# EasyEDA Pro project Příloha F.epro

# Board PCB_1
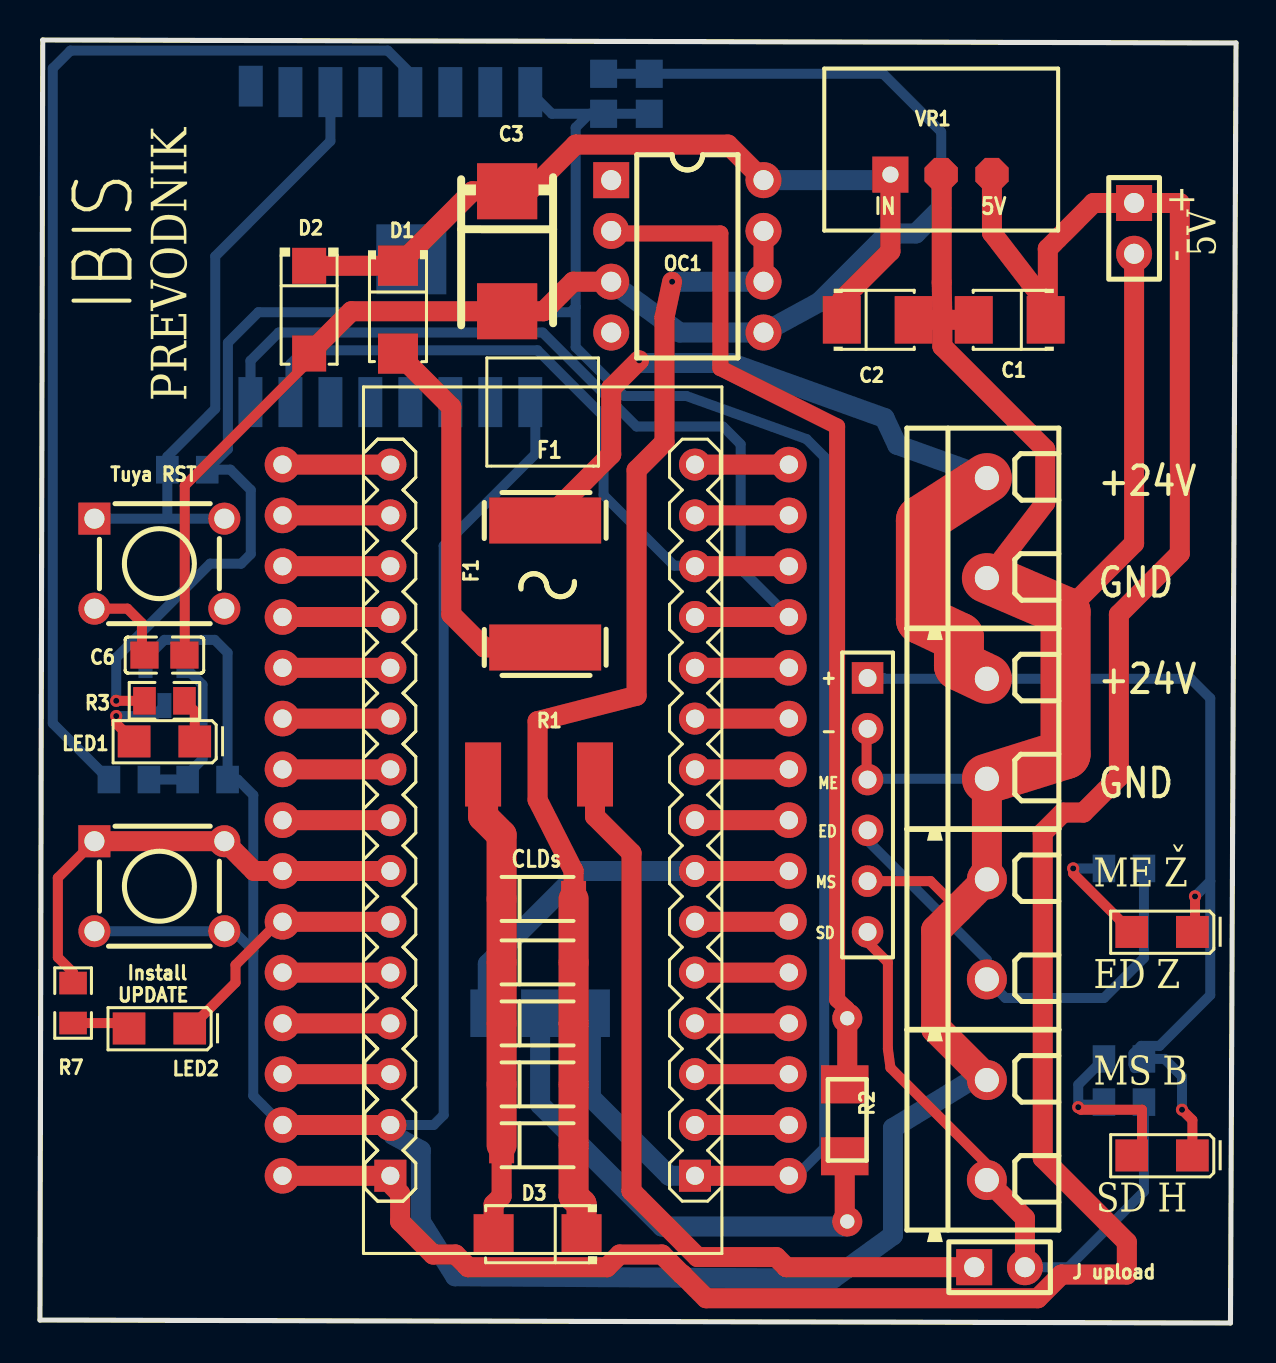
[diagram p0: board, top side]
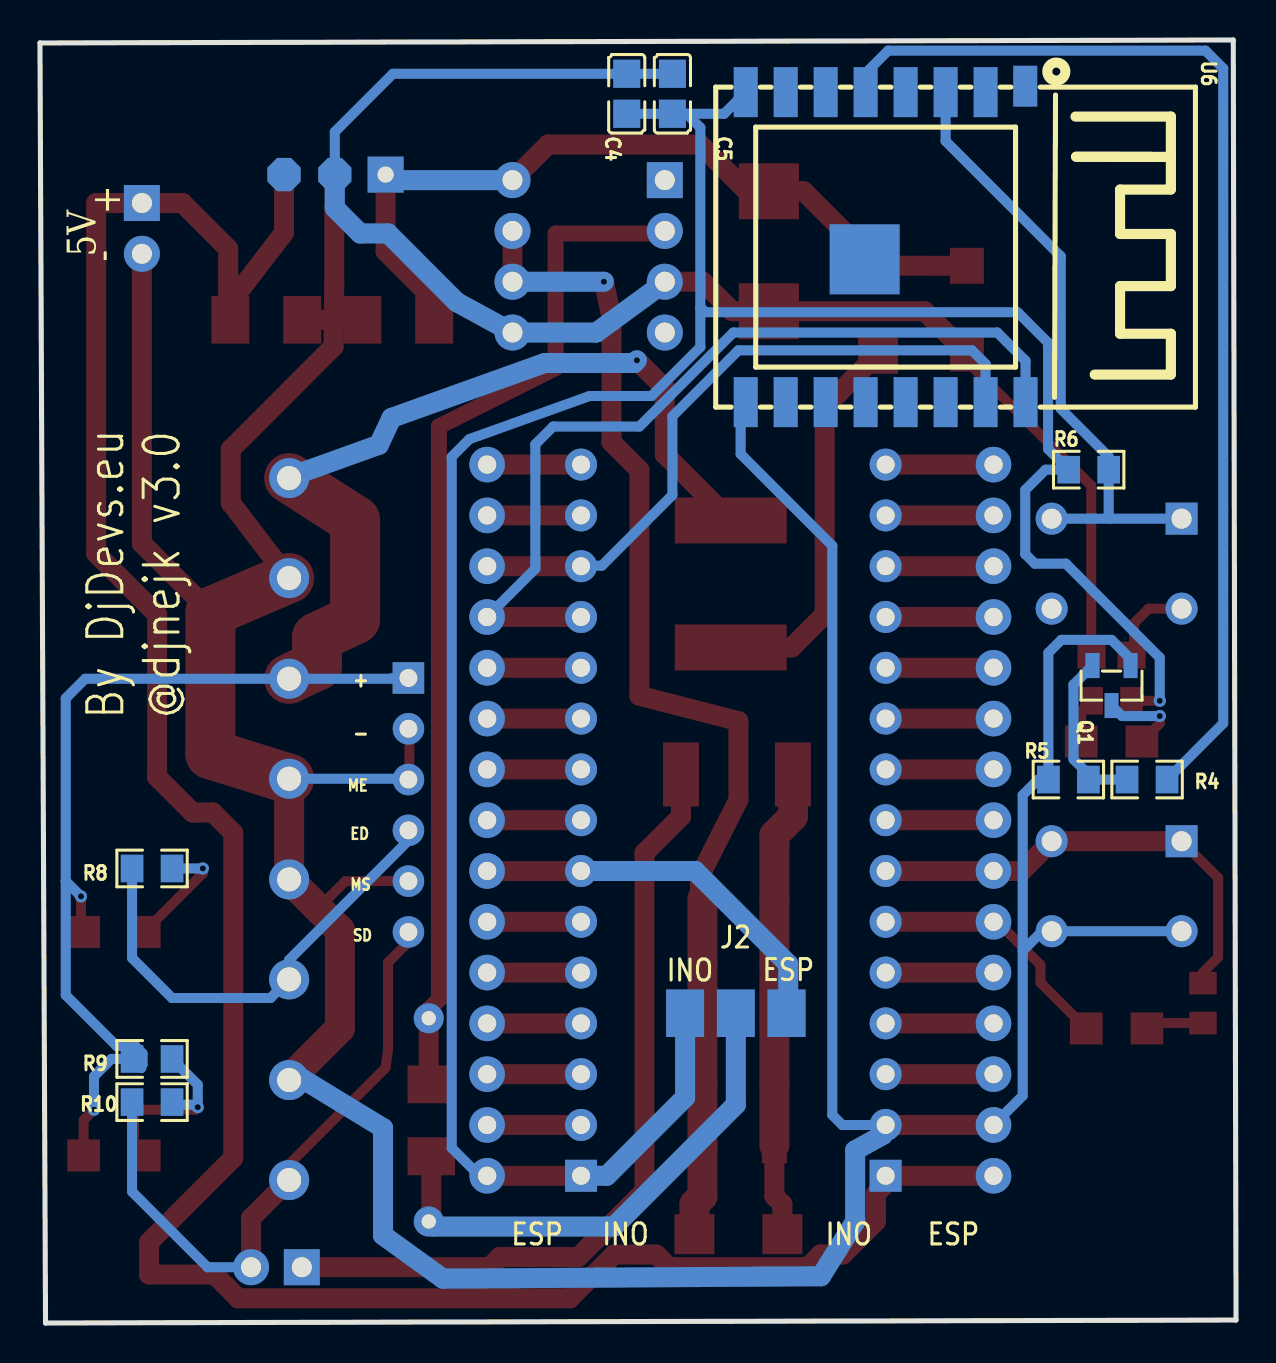
[diagram p1: board, bottom side, seen from below]

Outline 59.84 x 64.15 mm; copper layers: Top Layer, Bottom Layer. Coordinates in mm from the lower left corner of the outline.
Outline path: 0,0.15 0.14,64.15 59.84,64.01 59.56,0 0,0.15
Stack: Top Layer 0.035mm / Dielectric1 1.51mm FR4 er 4.5 / Bottom Layer 0.035mm

## Design rules (mm)
spacing Default (default): track to track 0.152, other pairs 0 to 0.152
track width Default (default): min 0.5, default 0.5, max 25.4
differential pair differentialPair (default): width min 0.127, default 0.254, max 2.54; gap min 0.152, default 0.152
via Default (default): diameter min 0.61, default 0.61, max 100.025; hole min 0.305, default 0.305, max 59.995

## Placement (name value [footprint] x y rotation side)
 Install
UPDATE  -  [KEY-TH_4P-L6.0-W6.0-P6.50-LS4.5]  5.97 21.84 0 top
C1  -  [CAP-SMD_L3.5-W2.8-FD]  48.52 50.16 180 top
C2  -  [CAP-SMD_L3.5-W2.8-FD]  41.92 50.16 0 top
C3  -  [CASE-D_7343]  23.37 53.59 90 top
C4  -  [C0805]  30.48 61.46 90 bottom
C5  -  [C0805]  28.2 61.46 90 bottom
C6  -  [C0805]  6.23 33.4 180 top
CLD1  -  [LL-34]  24.9 21.2 0 top
CLD2  -  [LL-34]  24.9 18.03 0 top
CLD3  -  [LL-34]  24.9 14.98 0 top
CLD4  -  [LL-34]  24.9 11.93 0 top
CLD5  -  [LL-34]  24.9 8.89 0 top
D1  -  [SMA_L4.3-W2.6-LS5.2-RD]  17.91 50.67 270 top
D2  -  [SMA_L4.4-W2.6-LS5.0-RD]  13.47 50.67 270 top
D3  -  [SMA_L4.3-W2.6-LS5.2-RD]  24.9 4.44 180 top
F1  -  [F2920]  25.28 36.95 90 top
H1  -  [HDR-F-2.54_1X6]  41.41 27.17 270 top
H2  -  [HDR-TH_2P-P2.54-V-M-1]  54.74 54.73 270 top
J upload  -  [HDR-TH_2P-P2.54-V-M-1]  48.01 2.79 0 top
LED1  -  [LED1206-RD]  6.23 29.08 180 top
LED2  -  [LED1206-RD]  5.97 14.73 180 top
LED3  -  [LED1206-RD]  56.14 19.55 180 top
LED SD  -  [LED1206-RD]  56.14 8.38 180 top
NOREF  -  [Pad_e602]  22.48 15.49 180 top
NOREF#2  -  [Pad_e603]  25.02 15.49 180 top
NOREF#3  -  [Pad_e124]  40.26 11.93 90 top
NOREF#4  -  [Pad_e604]  27.56 15.49 180 top
NOREF#5  -  [Pad_e123]  40.26 8.34 90 top
OC1  -  [DIP-8_L9.7-W6.4-P2.54-LS7.6-BL-1]  32.39 53.34 270 top
Q1  -  [SOT-23-3_L2.9-W1.3-P1.90-LS2.4-BR]  6.23 31.87 90 bottom
R1  -  [R2512]  24.77 27.43 0 top
R2  -  [REZISTOR]  40.26 10.28 270 top
R3  -  [R0805]  6.23 31.11 0 top
R4  -  [R0805]  4.45 27.17 180 bottom
R5  -  [R0805]  8.39 27.17 180 bottom
R6  -  [R0805]  7.37 42.67 180 bottom
R7  -  [R0805]  1.66 16 90 top
R8  -  [R0805]  54.23 22.73 180 bottom
R9  -  [R0805]  54.23 13.2 180 bottom
R10  -  [R0805]  54.23 11.04 180 bottom
Tuya RST  -  [KEY-TH_4P-L6.0-W6.0-P6.50-LS4.5]  5.97 37.97 0 top
U1  -  [COMM-TH_ARDUINO_NANO]  25.15 25.14 270 top
U1#2  -  [COMM-TH_ARDUINO_NANO#2]  25.15 25.27 180 bottom
U5  -  [ESP32-WROOM-30-DEVBOARD]  37.47 7.36 180 top
U5#2  -  [ESP32-WROOM-30-DEVBOARD#2]  11.94 7.49 0 bottom
U6  -  [WBR3]  17.53 53.97 270 bottom
VR1  -  [TSR-1]  45.09 58.92 0 top
X1  -  [CONN-TH_XY301V-A-5.0-2P]  47.38 39.75 270 top
X2  -  [CONN-TH_XY301V-A-5.0-2P]  47.38 29.71 270 top
X3  -  [CONN-TH_XY301V-A-5.0-2P]  47.38 19.68 270 top
X4  -  [CONN-TH_XY301V-A-5.0-2P]  47.38 9.65 270 top

## Footprints (pads in the part's own frame, mm; a bottom-side part is the same pattern mirrored in y, then rotated)
C0805
  rect 1.41x1.35 smd: 1(-1,0) 2(1,0)
CAP-SMD_L3.5-W2.8-FD
  rect 1.9x2.376 smd: 1(-1.798,0) 2(1.798,0)
CASE-D_7343
  rect 2.799x3.01 smd: 1(3,0) 2(-3,0)
COMM-TH_ARDUINO_NANO
  rect 1.6x1.6 hole 0.9: 1(17.78,7.62) 30(17.78,-7.62)
  round 1.6 hole 0.9: 2(15.24,7.62) 3(12.7,7.62) 4(10.16,7.62) 5(7.62,7.62) 6(5.08,7.62) 7(2.54,7.62) 8(0,7.62) 9(-2.54,7.62) 10(-5.08,7.62) 11(-7.62,7.62) 12(-10.16,7.62) 13(-12.7,7.62) 14(-15.24,7.62) 15(-17.78,7.62) 16(-17.78,-7.62) 17(-15.24,-7.62) 18(-12.7,-7.62) 19(-10.16,-7.62) 20(-7.62,-7.62) 21(-5.08,-7.62) 22(-2.54,-7.62) 23(0,-7.62) 24(2.54,-7.62) 25(5.08,-7.62) 26(7.62,-7.62) 27(10.16,-7.62) 28(12.7,-7.62) 29(15.24,-7.62)
CONN-TH_XY301V-A-5.0-2P
  round 2 hole 1.205x1.2: 1(-2.5,0) 2(2.5,0)
DIP-8_L9.7-W6.4-P2.54-LS7.6-BL-1
  rect 1.8x1.8 hole 1: 1(-3.81,-3.81)
  round 1.8 hole 1: 2(-1.27,-3.81) 3(1.27,-3.81) 4(3.81,-3.81) 5(3.81,3.81) 6(1.27,3.81) 7(-1.27,3.81) 8(-3.81,3.81)
ESP32-WROOM-30-DEVBOARD
  round 1.778 hole 0.914: 1(0,0) 2(0,-2.54) 3(0,-5.08) 4(0,-7.62) 5(0,-10.16) 6(0,-12.7) 7(0,-15.24) 8(0,-17.78) 9(0,-20.32) 10(0,-22.86) 11(0,-25.4) 12(0,-27.94) 13(0,-30.48) 14(0,-33.02) 15(0,-35.56) 16(25.337,-35.56) 17(25.337,-33.02) 18(25.337,-30.48) 19(25.337,-27.94) 20(25.337,-25.4) 21(25.337,-22.86) 22(25.337,-20.32) 23(25.337,-17.78) 24(25.337,-15.24) 25(25.337,-12.7) 26(25.337,-10.16) 27(25.337,-7.62) 28(25.337,-5.08) 29(25.337,-2.54) 30(25.337,0)
F2920
  rect 2.3x5.6 smd: 1(-3.175,0) 2(3.175,0)
HDR-F-2.54_1X6
  rect 1.575x1.575 hole 0.889: 1(-5.08,0)
  round 1.575 hole 0.889: 2(-2.54,0) 3(0,0) 4(2.54,0) 5(5.08,0) 6(7.62,0)
HDR-TH_2P-P2.54-V-M-1
  rect 1.8x1.8 hole 1: 1(-1.27,0)
  round 1.8 hole 1: 2(1.27,0)
KEY-TH_4P-L6.0-W6.0-P6.50-LS4.5
  rect 1.6x1.6 hole 1: 1(-3.25,2.25)
  round 1.6 hole 1: 2(3.25,2.25) 3(-3.25,-2.25) 4(3.25,-2.25)
LED1206-RD
  rect 1.635x1.6 smd: 1(-1.518,0) 2(1.518,0)
LL-34
  rect 1.25x1.8 smd: 1(1.8,0) 2(-1.8,0)
Pad_e123
  rect 1.9x2.376 smd: 1(0,0)
Pad_e124
  rect 1.9x2.376 smd: 2(0,0)
Pad_e602
  rect 1.9x2.376 smd far side: 1(0,0)
Pad_e603
  rect 1.9x2.376 smd far side: 1(0,0)
Pad_e604
  rect 1.9x2.376 smd far side: 1(0,0)
R0805
  rect 1.133x1.377 smd: 1(-1,0) 2(1,0)
R2512
  rect 1.8x3.2 smd: 1(-2.6,0) 2(3,0)
REZISTOR
  round 1.5 hole 0.711: 1(5.207,0.128) 2(-4.954,0.128)
SMA_L4.3-W2.6-LS5.2-RD
  rect 2x2 smd: 1(-2.2,0) 2(2.2,0)
SMA_L4.4-W2.6-LS5.0-RD
  rect 1.8x1.7 smd: 1(-2.192,0) 2(2.192,0)
SOT-23-3_L2.9-W1.3-P1.90-LS2.4-BR
  rect 1.25x0.7 smd: 1(1,-0.95) 2(1,0.95) 3(-1,0)
TSR-1
  rect 1.8x1.8 hole 0.805x0.8: 1(-2.54,-1.5)
  custom 0x0 hole 0.805x0.8: 2(0,-1.5) 3(2.54,-1.5)
WBR3
  rect 2.042x1.2 smd: 1(-7.874,6.985)
  rect 2.5x1.2 smd: 2(-7.575,5) 3(-7.575,3) 4(-7.575,1) 5(-7.575,-1) 6(-7.575,-3) 7(-7.575,-5) 8(-7.575,-7) 9(7.925,-7) 10(7.925,-5) 11(7.925,-3) 12(7.925,-1) 13(7.925,1) 14(7.925,3) 15(7.925,5) 16(7.925,7)
  rect 3.5x3.5 smd: 17(0.784,-1.05)

## Nets
GND:  Install
UPDATE.3  Install
UPDATE.4 C1.2 C2.2 C3.2 C4.2 C6.1 D2.2 H1.2 H1.3 H1.5 H2.2 OC1.3 OC1.5 Q1.1 R5.1 U1.29 U5.29 U6.9 VR1.2 X1.2 X2.2 X3.1 X4.1
1_1: C2.1 C3.1 D1.1 D2.1 OC1.8 VR1.1
D1_2: D1.2 F1.1
D3_1: CLD1.1 CLD2.1 CLD3.1 CLD4.1 CLD5.1 D3.1 OC1.6 OC1.7
D3_2: CLD1.2 CLD2.2 CLD3.2 CLD4.2 CLD5.2 D3.2 R1.1
F1_2: F1.2 H1.1 LED3.1 R9.1 X1.1 X2.1
OC1_2: NOREF#3.2 OC1.2 R2.2
R1_2: H1.6 J upload.1 J upload.2 R1.2 R10.1 X4.2
U1_1: NOREF#2.1 NOREF#5.1 R2.1
U1_2: U1.2 U5.2
U1_3: U1.3 U5.3
U1_4: U1.4 U5.4
U1_5: U1.5 U5.5
U1_6: U1.6 U5.6
U1_7: NOREF.1 U1.7 U5.7
U1_8: U1.8 U5.8
U1_9: U1.9 U5.9
U1_10: U1.10 U5.10
U1_11: U1.11 U5.11
U1_12: U1.12 U5.12
U1_13: U1.13 U5.13
U1_14: U1.14 U5.14
U1_15: U1.15 U5.15
U1_16: U1.16 U5.16
U1_17: U1.17 U5.17
U1_18: U1.18 U5.18
U1_19: U1.19 U5.19
U1_20: U1.20 U5.20
U1_21: U1.21 U5.21
U1_22: U1.22 U5.22
U1_23: U1.23 U5.23
U1_24:  Install
UPDATE.1  Install
UPDATE.2 R7.2 U1.24 U5.24
U1_25: LED2.1 U1.25 U5.25
U1_26: U1.26 U5.26
U1_27: U1.27 U5.27
U1_28: U1.28 U5.28
U1_30: C1.1 H2.1 U1.30 U5.30 VR1.3
X3_2: H1.4 R8.1 X3.2

Pads without a net: C4 1; C5 1 2; C6 2; LED1 1 2; LED2 2; LED3 2; LED SD 1 2; NOREF#4 1; OC1 1 4; Q1 2 3; R3 1 2; R4 1 2; R5 2; R6 1 2; R7 1; R8 2; R9 2; R10 2; Tuya RST 1 2 3 4; U1 1; U5 1; U6 1 2 3 4 5 6 7 8 10 11 12 13 14 15 16 17

## Via types
v1: diameter 0.61, hole 0.305, Top Layer to Bottom Layer, 8 vias

## Routing (per net, layer and track width the routed paths; a pad name or vN(x,y) marks a point on that pad's centre or on a via; arc(x,y) is an arc through that point)
GND: length 292.2
  Top Layer w0.5: 45.92,20.73 44.56,22.09 40.9,22.09 ; 7.24,33.92 7.24,41.87 13.47,48.1 D2.2 ; 40.9,27.17 41.36,27.63 41.36,29.25 40.9,29.71
  Top Layer w1: 45.15,50.16 C1.2 ; 45.15,50.16 44.68,50.16 ; 45.15,50.16 45.12,52.03 45.12,57.4 VR1.2 ; 45.15,50.16 45.15,48.83 50.3,43.68 50.3,41.02 47.42,37.25 X1.2 ; 51.31,35.56 54.74,38.98 H2.2 ; OC1.3 26.67,52.07 25.2,50.59 C3.2 15.58,50.59 D2.2 ; U5.29 U1.29
  Top Layer w1.5: X2.2 X3.1 44.84,19.64 44.84,14.73 47.38,12.19 X4.1
  Top Layer w2.5: X1.2 51.31,35.56 51.31,28.44 X2.2
  Bottom Layer w0.5: U1.29 19.7,9.9 20.2,10.4 20.2,38.86 24.78,43.45 24.78,46.17 ; X2.2 40.94,27.21 40.9,27.17 ;  Install
UPDATE.3  Install
UPDATE.4 9.69,19.59 10.67,18.61 ; U5.29 10.67,11.36 10.67,18.61 ; C4.2 42.18,62.46 45.09,59.56 VR1.2 ; 10.67,18.61 10.67,26.4 9.89,27.17 R5.1 9.39,33.51 8.74,34.16 6.23,34.16 5.28,33.21 Q1.1
  Bottom Layer w1: VR1.2 45.09,55.75 43.82,54.48 42.42,54.48 38.99,51.05 OC1.5 32.01,49.53 28.58,52.03 OC1.3 ; X4.1 46.83,12.28 42.68,9.75 42.68,4.38 39.68,2.22 20.77,2.34 19.05,5.08 19.05,8.63 17.67,9.4 U1.29
(no net): length 262.6
  Top Layer w0.5: R3.1 v1(3.81,31.11) ; LED1.2 3.81,29.97 v1(3.81,30.35) ; v1(51.95,10.79) 52.08,10.66 55.14,10.66 55.14,8.9 LED SD.2 ; R7.1 4.19,15 LED2.2 ; v1(51.69,22.73) 51.69,22.48 LED3.2 ; LED1.1 7.75,30.59 R3.2 ; v1(57.14,10.66) 57.66,10.15 LED SD.1 ; C6.2 5.1,33.52 5.1,34.99 4.38,35.72 Tuya RST.3
  Top Layer w1: U1.1 U5.1
  Bottom Layer w0.5: v1(3.81,30.35) 5.7,30.35 Q1.3 ; U5.1 37.85,7.36 39.24,8.75 39.24,43.31 38.36,44.2 32.34,46.35 29.25,46.35 26.8,48.8 26.8,50.8 ; 27.49,60.46 26.8,59.77 26.8,50.8 ; 27.49,60.46 25.61,60.46 U6.8 ; 27.49,60.46 C5.1 C4.1 ; 55.23,13.2 56.27,13.2 57.14,12.33 v1(57.14,10.66) ; 26.8,50.8 26.55,50.54 10.93,50.54 9.4,49.02 9.4,43.7 R6.1 9.53,42.67 10.55,41.65 10.55,38.45 10.07,37.97 8.51,37.97 3.81,33.27 v1(3.81,31.11) ; R4.1 7.12,27.17 8.13,28.19 8.13,31.92 Q1.2 ; R8.2 v1(51.69,22.73) ; 6.26,40.22 2.72,40.22 ; 6.26,40.22 6.37,40.33 R6.2 6.37,43.32 8.77,45.72 8.77,53.34 14.53,59.1 U6.3 ; 6.26,40.22 Tuya RST.2 ; 53.23,10.92 52.08,10.92 v1(51.95,10.79) 51.95,11.92 R9.2 ; R4.2 0.64,29.98 0.64,62.73 1.53,63.62 17.4,63.62 18.53,62.5 U6.5 ; C5.2 30.48,62.46
  Bottom Layer w1: NOREF#4.1 27.56,11.28 31.48,7.36 U1.1
1_1: length 40.8
  Top Layer w1: OC1.8 34.42,58.92 26.8,58.92 24.34,56.46 23.5,56.46 C3.1 21.63,56.59 D1.1 ; D2.1 17.91,52.87 ; C2.1 40.12,51.16 42.55,53.59 VR1.1
  Bottom Layer w0.5: 42.27,57.15 VR1.1
  Bottom Layer w1: OC1.8 42.27,57.15
D1_2: length 22.8
  Top Layer w0.5: F1.1 21.98,33.78
  Top Layer w1: D1.2 20.58,45.8 20.58,35.43 22.23,33.78 F1.1
D3_1: length 59.8
  Top Layer w1: CLD1.1 26.7,22.61 ; v1(31.63,52.07) 31.25,50.29 31.25,44.05 29.85,42.65 29.85,31.36 24.9,30.09 24.9,26.16 26.7,22.6 ; OC1.6 OC1.7
  Top Layer w1.5: CLD1.1 CLD2.1 CLD3.1 CLD4.1 CLD5.1 26.7,6.34 27.1,5.94 D3.1
  Bottom Layer w1: OC1.6 v1(31.63,52.07)
D3_2: length 23.5
  Top Layer w1: CLD5.2 23.1,6.34 22.7,5.94 D3.2
  Top Layer w1.5: CLD5.2 CLD4.2 CLD3.2 CLD2.2 CLD1.2 23.1,24.4 22.17,25.33 R1.1
F1_2: length 84.6
  Top Layer w0.5: v1(57.79,21.33) 57.79,19.69 LED3.1
  Top Layer w1: F1.2 28.58,43.43 28.58,46.74 v1(29.98,48.14)
  Top Layer w2.5: X2.1 45.98,32.88 45.98,34.29 44.07,35.19 44.07,40.13 X1.1
  Bottom Layer w0.5: 58.55,22.09 58.55,16.39 56.01,13.86 55.09,13.86 54.71,13.47 54.71,12.93 54.77,12.87 54.77,12.74 ; 58.55,22.09 58.55,31.24 57.58,32.21 X2.1 42.23,32.21 42.19,32.25 40.9,32.25 ; 58.55,22.09 58.55,22.09 v1(57.79,21.33)
  Bottom Layer w1: v1(29.98,48.14) 30.11,48 34.59,48 42.25,45.25 42.89,43.91 47.34,42.31 X1.1
OC1_2: length 51.9
  Top Layer w0.8: R2.2 40.37,15.71 39.88,16.16 39.88,44.83 34.04,47.75 34.04,54.48 28.71,54.48 OC1.2
  Top Layer w1: R2.2 40.39,12.06 NOREF#3.2
R1_2: length 72.5
  Top Layer w0.5: X4.2 47.38,7.94 42.55,12.76 42.42,13.71 42.42,18.03 40.9,19.55
  Top Layer w1: J upload.1 37.34,2.79 36.83,3.3 32.9,3.3 29.6,6.6 29.6,23.5 27.77,25.33 ; X4.2 49.28,5.24 J upload.2 ; 27.77,25.33 R1.2
  Bottom Layer w0.5: R10.1 55.23,6.57 51.46,2.79 J upload.2
U1_1: length 25.9
  Top Layer w1: R2.1 40.26,5.2 NOREF#5.1
  Bottom Layer w1: R2.1 40.14,4.82 31.12,4.82 25.02,10.92 NOREF#2.1
U1_2: length 4.7
  Top Layer w1: U5.2 U1.2
U1_3: length 4.7
  Top Layer w1: U1.3 U5.3
U1_4: length 4.7
  Top Layer w1: U5.4 U1.4
U1_5: length 4.7
  Top Layer w1: U1.5 U5.5
U1_6: length 4.7
  Top Layer w1: U5.6 U1.6
U1_7: length 19.5
  Top Layer w1: U1.7 U5.7
  Bottom Layer w1: U1.7 27.06,22.6 22.41,17.95 22.41,15.57 NOREF.1
U1_8: length 4.7
  Top Layer w1: U5.8 U1.8
U1_9: length 4.7
  Top Layer w1: U1.9 U5.9
U1_10: length 4.7
  Top Layer w1: U5.10 U1.10
U1_11: length 4.7
  Top Layer w1: U1.11 U5.11
U1_12: length 43.8
  Top Layer w1: U5.12 U1.12
  Bottom Layer w0.5: 10.53,46.05 10.53,48.11 11.94,49.53 25.15,49.53 29.85,44.83 34.17,44.83 35.06,43.94 35.06,37.71 U5.12
U1_13: length 33.9
  Top Layer w1: U1.13 U5.13
  Bottom Layer w0.5: U1.13 32.74,37.87 31.73,37.87 28.2,41.4 28.2,45.33 24.9,48.64 13.21,48.64 12.53,47.95 12.53,46.05
U1_14: length 4.7
  Top Layer w1: U5.14 U1.14
U1_15: length 4.7
  Top Layer w1: U1.15 U5.15
U1_16: length 5.4
  Top Layer w1: U5.16 U1.16
U1_17: length 5.4
  Top Layer w1: U5.17 U1.17
U1_18: length 5.4
  Top Layer w1: U1.18 U5.18
U1_19: length 5.4
  Top Layer w1: U5.19 U1.19
U1_20: length 5.4
  Top Layer w1: U1.20 U5.20
U1_21: length 5.4
  Top Layer w1: U5.21 U1.21
U1_22: length 5.4
  Top Layer w1: U5.22 U1.22
U1_23: length 5.4
  Top Layer w1: U1.23 U5.23
U1_24: length 23.6
  Top Layer w0.5: R7.2 1.66,17.52 0.89,18.28 0.89,22.26  Install
UPDATE.1
  Top Layer w1:  Install
UPDATE.1  Install
UPDATE.2 10.71,22.6 U5.24 U1.24
U1_25: length 12.6
  Top Layer w0.5: LED2.1 9.78,17.02 9.78,17.9 11.94,20.06
  Top Layer w1: U5.25 U1.25
U1_26: length 5.4
  Top Layer w1: U1.26 U5.26
U1_27: length 5.4
  Top Layer w1: U5.27 U1.27
U1_28: length 5.4
  Top Layer w1: U1.28 U5.28
U1_30: length 122.9
  Top Layer w1: U1.30 U5.30 ; VR1.3 47.63,54.52 50.42,50.89 50.42,53.72 52.71,56 H2.1 57.03,56 57.03,38.48 53.98,35.43 53.98,27.3 52.2,25.52 51.19,25.52 50.17,24.51 50.17,8.25 54.38,4.04 54.38,2.42 51.11,2.42 49.92,1.24 33.33,1.24 32.14,2.42 32.12,2.42 31.12,3.42 29,3.42 28.37,2.79 21.43,2.79 20.79,3.42 19.67,3.42 18.02,5.08 18.02,6.47 17.64,6.85
X3_2: length 23.7
  Bottom Layer w0.5: R8.1 55.23,18.25 53.23,16.25 48.3,16.25 X3.2 47.38,18.16 40.9,24.63

## Text on the board
Bottom Silkscreen Layer: SD | ED | MS | ME | + | - | ESP | INO | J2 | By DjDevs.eu / @djnejk v3.0 | 5V
Top Silkscreen Layer: MS | SD | ME | ED | + | - | CLDs | F1 | IN | 5V | +24V | GND | IBIS | ME Z | ED Z | MS B | SD H | ˇ | PREVODNIK
